# EAGLE design FDL-3 PWR - v2 (EAGLE 9.1.0)
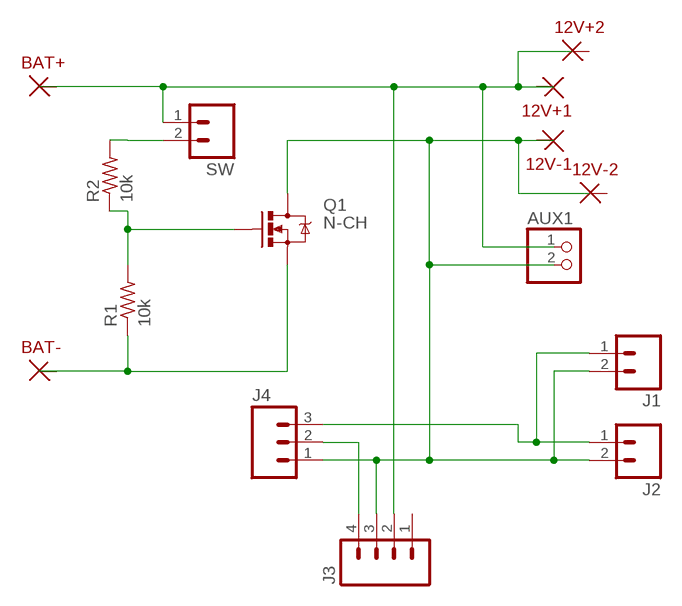
[diagram p0: schematic, sheet 1]

## Parts
12V+1  PWRPAD18  [PWRPAD18]
12V+2  PWRPAD18  [PWRPAD18]
12V-1  PWRPAD18  [PWRPAD18]
12V-2  PWRPAD18  [PWRPAD18]
AUX1  PINHD-1X2  [1X02]
BAT+  PWRPAD16  [PWRPAD16]
BAT-  PWRPAD16  [PWRPAD16]
J1  M02PTH  [1X02]
J2  M02PTH  [1X02]
J3  M04PTH  [1X04]
J4  M03PTH  [1X03]
Q1  N-CH  MOSFET-NCHANNELFQP30N06L  [TO220V]
R1  10k  R-US_0204/5  [0204/5]
R2  10k  R-US_0204/5  [0204/5]
SW  M02PTH  [1X02]

## Nets
N$1: R2.2 SW.2
N$2: J3.4 J4.2
N$3: Q1.1(G) R1.2 R2.1
N$4: BAT-.P$1 Q1.3(S) R1.1
N$6: J1.1 J2.1 J4.3
N$7: 12V+1.P$1 12V+2.P$1 AUX1.1 BAT+.P$1 J3.2 SW.1
N$10: 12V-1.P$1 12V-2.P$1 AUX1.2 J1.2 J2.2 J3.3 J4.1 Q1.2(D)
Unconnected: J3.1

## Library data of the parts
12V+1 12V+2 12V-1 12V-2 = PWRPAD:PWRPAD18
AUX1 = pinhead:PINHD-1X2: PIN HEADER
BAT+ BAT- = PWRPAD:PWRPAD16
J1 J2 SW = SparkFun-Connectors:M02: Standard 2-pin 0.1" header. Use with - straight break away headers ( PRT-00116) - right angle break away headers (PRT-00553) - swiss pins (PRT-00743) - machine pins (PRT-00117) - female headers (PRT-00115) Molex polarized connector foot print use with: PRT-08233 with associated crimp pins and housings. 2.54_SCREWTERM for use with PRT-10571. 3.5mm Screw Terminal footprints for PRT-08084 5mm Screw Terminal footprints for use with PRT-08432
J3 = SparkFun-Connectors:M04: Header 4 Standard 4-pin 0.1" header. Use with straight break away headers (SKU : PRT-00116), right angle break away headers (PRT-00553), swiss pins (PRT-00743), machine pins (PRT-00117), and female headers (PRT-00115). Molex polarized connector foot print use with SKU : PRT-08231 with associated crimp pins and housings. 1MM SMD Version SKU: PRT-10208; PROD_ID: CONN-09696
J4 = SparkFun-Connectors:M03: Header 3 Standard 3-pin 0.1" header. Use with straight break away headers (SKU : PRT-00116), right angle break away headers (PRT-00553), swiss pins (PRT-00743), machine pins (PRT-00117), and female headers (PRT-00115). Molex polarized connector foot print use with SKU : PRT-08232 with associated crimp pins and housings.
Q1 = SparkFun-DiscreteSemi:MOSFET-NCHANNEL: Common NMOSFET Parts MFG P/N Store ID Prod ID FDD8780 TRANS-09984 SI7820DN TRANS-11055 FDS6630A IC-08089 2N7002PW TRANS-11151 FQP30N06L COM-10213 TRANS-10060 BSS123LT1G TRANS-08345 BSS138 TRANS-00830 BS170 2N7000; PROD_ID: TRANS-10060
R1 R2 = resistor:R-US_: RESISTOR, American symbol

## Board
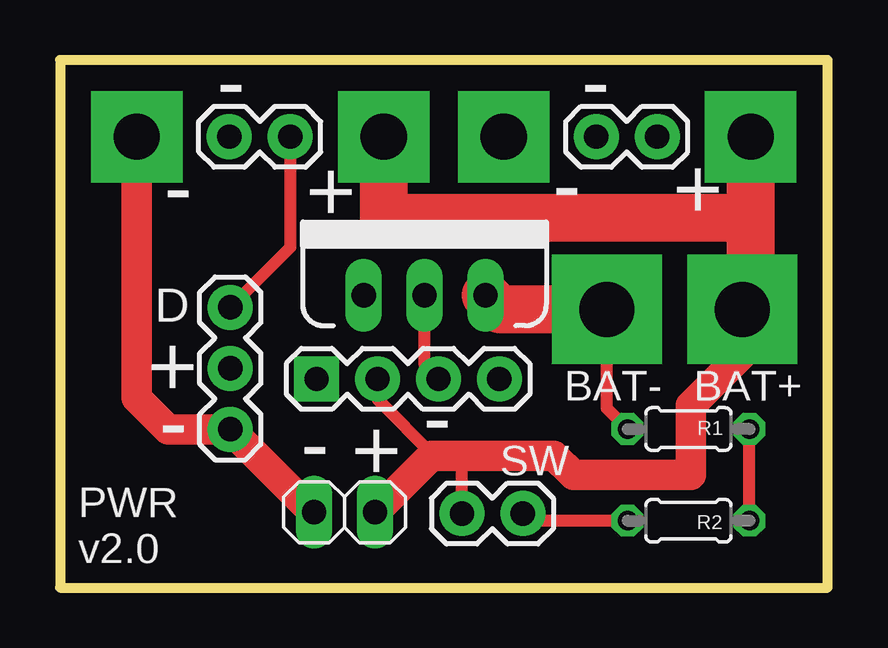
[diagram p1: board, top side]
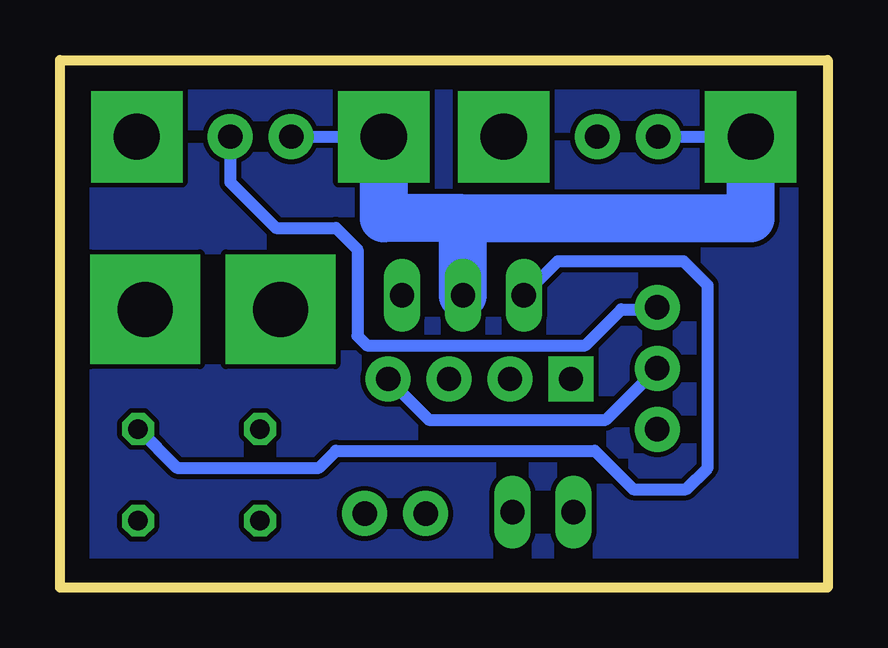
[diagram p2: board, bottom side, seen from below]

Size 32 x 22 mm. Coordinates in mm from the lower left corner, seen from the top.
Outline: 0,0 32,0 32,22 0,22 0,0
Copper layers (1*16): Top 0.035mm / dielectric 1.5mm / Bottom 0.035mm
Design rules "default": minimum track width 10mil, minimum drill 24mil, track to track 8mil, track to pad 8mil, pad to pad 8mil, via to via 8mil, smd to smd 8mil, copper to edge 40mil, drill to drill 8mil, minimum pad ring 10mil, minimum via ring 8mil, stop-mask expansion 4mil, vias tented up to drill 0mil, thermal gap 10mil

### Footprints (pad centres in the part's own frame; a part is rotated, then mirrored left to right if it is on the bottom)
PWRPAD18 = drill 1.93 pad 3.81 square: P$1 0,0
1X02 = drill 1.016 long: 1 -1.27,0; 2 1.27,0
PWRPAD16 = drill 2.286 pad 4.572 square: P$1 0,0
1X02' = drill 1.016 pad 1.88: 1 0,0; 2 2.54,0
1X04 = drill 1.016 pad 1.88 square: 1 0,0 | drill 1.016 pad 1.88: 2 2.54,0; 3 5.08,0; 4 7.62,0
1X03 = drill 1.016 pad 1.88: 1 0,0; 2 2.54,0; 3 5.08,0
TO220V = drill 1.016 long: 1 -2.54,0; 2 0,0; 3 2.54,0
0204/5 = drill 0.813 octagon: 1 -2.54,0; 2 2.54,0

### Placement (x,y rotation side)
12V+1  28.8,18.8 0 top
12V+2  13.5,18.8 0 top
12V-1  18.5,18.8 0 top
12V-2  3.2,18.8 0 top
AUX1  11.86,3.14 180 top
BAT+  28.45,11.6 0 top
BAT-  22.8,11.6 0 top
J1  [1X02']  9.6,18.8 180 top
J2  [1X02']  24.9,18.8 180 top
J3  10.7,8.7 0 top
J4  7.1,6.6 90 top
Q1  15.2,12.19 0 top
R1  26.2,6.61 0 top
R2  26.2,2.79 180 top
SW  [1X02']  16.76,3.09 0 top

### Tracks (layer width: path | path; a pad name or v marks a point on that pad's centre or on a via)
N$1
  Top 0.508: R2.2 19.6,2.79 SW.2
N$2
  Bottom 0.508: J3.4 16.62,7 9.24,7 J4.2
N$3
  Top 0.508: R2.1 R1.2
  Bottom 0.508: Q1.1 11.25,13.6 6,13.6 5,12.6 5,5 5.9,4.1 8.1,4.1 9.7,5.7 20.5,5.7 21.2,5 27.13,5 R1.2
N$4
  Top 0.508: R1.1 22.8,7.47 BAT-.P$1
  Top 2: BAT-.P$1 18.33,11.6 Q1.3
N$6
  Top 0.508: J1.1 9.6,14.18 J4.3
  Bottom 0.508: J2.1 24.9,16.9 23,15 20.5,15 19.6,14.1 19.6,10.5 19.2,10.1 10.1,10.1 8.6,11.6 7.18,11.6 J4.3
N$7
  Top 0.508: SW.1 16.76,5.44 16.7,5.5 | 15.6,5.5 13.24,7.86 J3.2
  Top 1.27: BAT+.P$1 28.45,9.75 26.3,7.6 26.3,4.7 21.4,4.7 20.6,5.5 16.7,5.5 16,5.5 | 16,5.5 15.6,5.5 | 16,5.5 15.49,5.5 AUX1.1
  Top 2: BAT+.P$1 28.8,11.95 28.8,16 | 28.8,16 12V+1.P$1 | 28.8,16 28.2,15.4 13.5,15.4 12V+2.P$1
N$9
  pour Bottom: 0,0 32,0 32,22 0,22
N$10
  Top 0.508: J3.3 15.2,9.28 Q1.2 | AUX1.2 10.56,3.14
  Top 1.27: 10.56,3.14 J4.1 4.5,6.6 3.2,7.9 12V-2.P$1
  Bottom 0.508: J1.2 12V-2.P$1 | J2.2 12V-1.P$1
  Bottom 2: Q1.2 15.2,15.4 | 15.2,15.4 18.5,15.4 12V-1.P$1 | 15.2,15.4 3.2,15.4 12V-2.P$1

### Text on the board
tPlace: - | - | - | - | + | + | D | + | - | - | - | + | PWR / v2.0